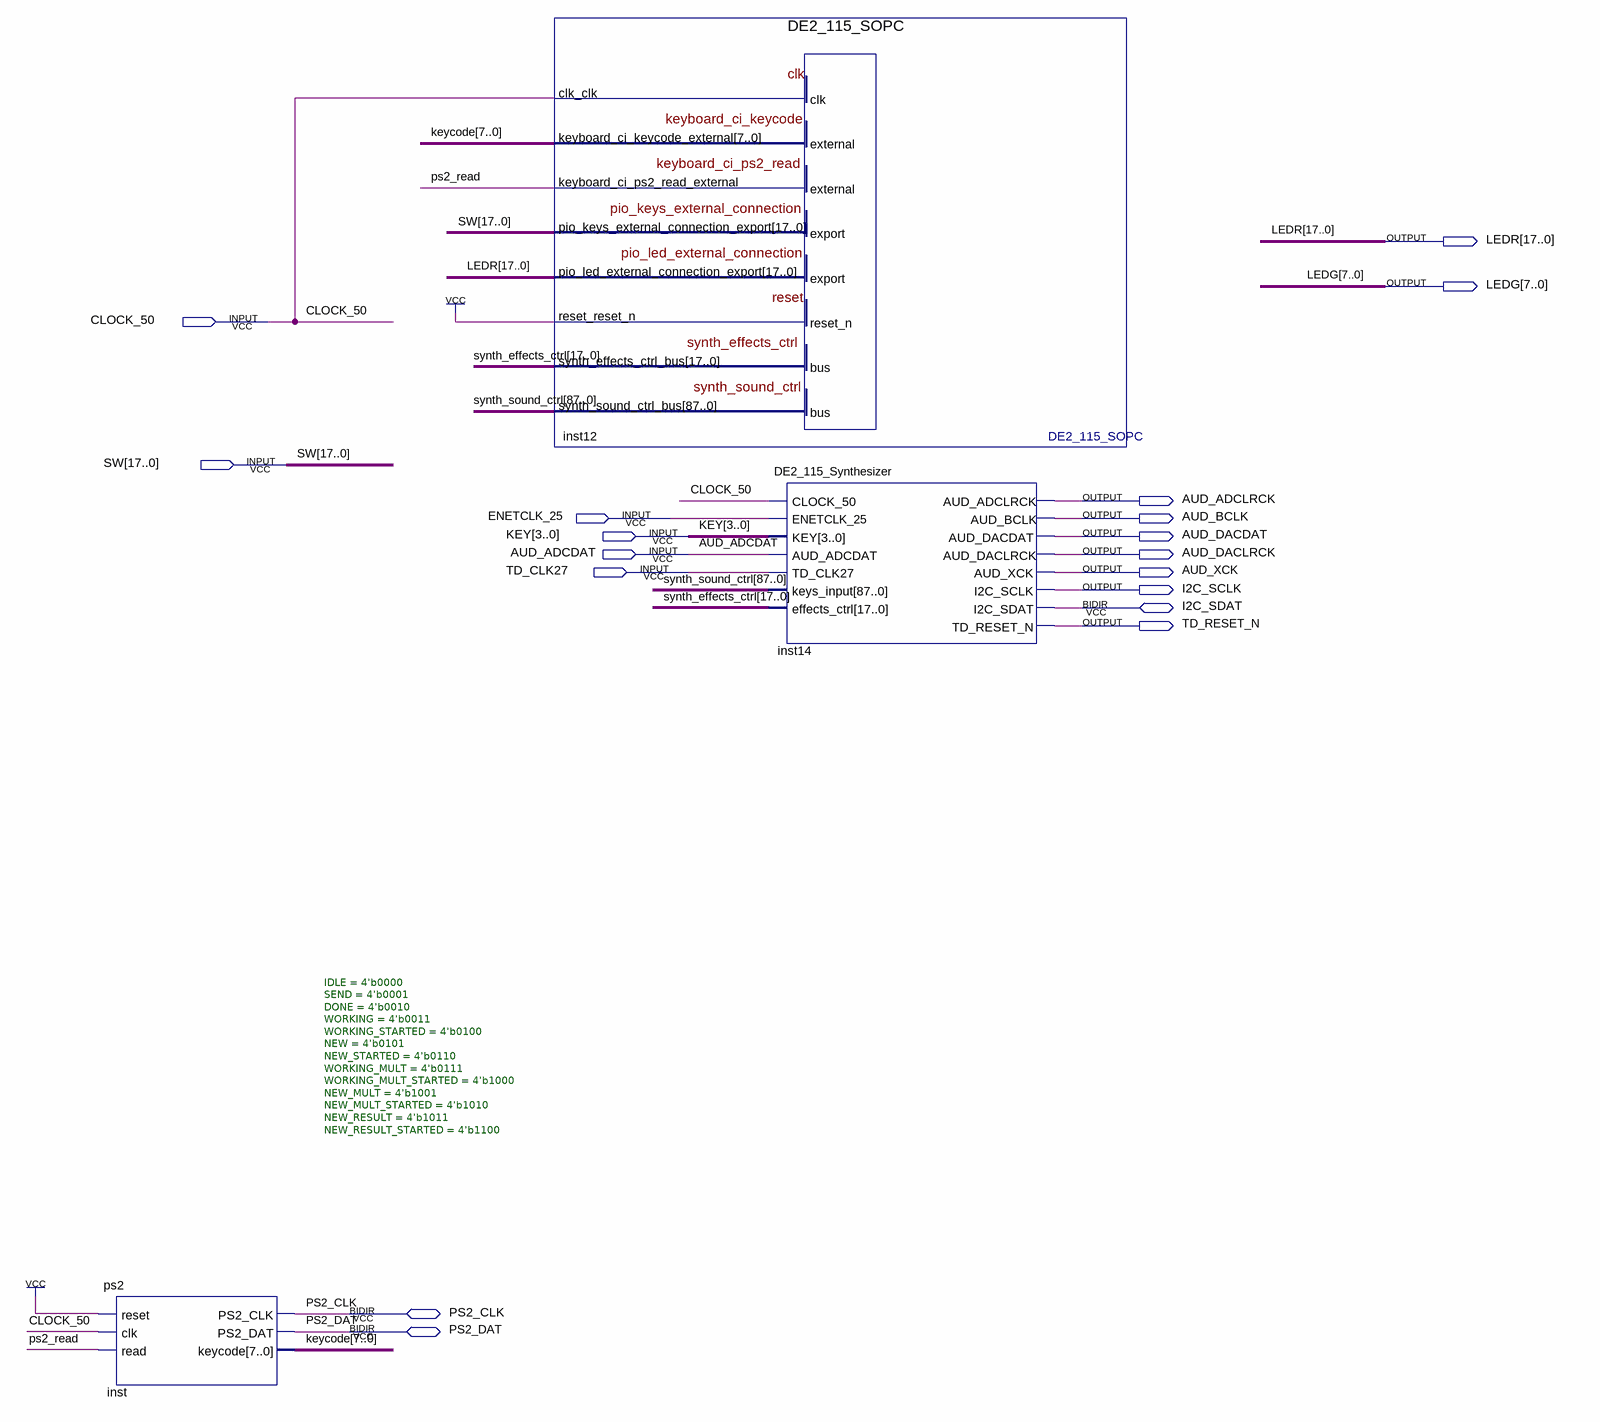
[diagram p0: schematic sheet]
// Quartus schematic Lab7.bdf as structural Verilog: 3 symbols, 18 pins
module Lab7 (
  input  CLOCK_50,
  input  [17:0] SW,
  input  ENETCLK_25,
  input  [3:0] KEY,
  input  AUD_ADCDAT,
  input  TD_CLK27,
  inout  I2C_SDAT,
  inout  PS2_CLK,
  inout  PS2_DAT,
  output [17:0] LEDR,
  output [7:0] LEDG,
  output AUD_ADCLRCK,
  output AUD_BCLK,
  output AUD_DACDAT,
  output AUD_DACLRCK,
  output AUD_XCK,
  output I2C_SCLK,
  output TD_RESET_N
);

  wire ps2_read;
  wire [7:0] keycode;
  wire [17:0] synth_effects_ctrl;
  wire [87:0] synth_sound_ctrl;

  ps2 #(.IDLE(4'b0000), .SEND(4'b0001), .DONE(4'b0010), .WORKING(4'b0011), .WORKING_STARTED(4'b0100), .NEW(4'b0101), .NEW_STARTED(4'b0110), .WORKING_MULT(4'b0111), .WORKING_MULT_STARTED(4'b1000), .NEW_MULT(4'b1001), .NEW_MULT_STARTED(4'b1010), .NEW_RESULT(4'b1011), .NEW_RESULT_STARTED(4'b1100)) inst (
    .reset(1'b1), .clk(CLOCK_50), .read(ps2_read), .keycode(keycode), .PS2_CLK(PS2_CLK), .PS2_DAT(PS2_DAT));
  DE2_115_SOPC inst12 (
    .clk_clk(CLOCK_50), .keyboard_ci_keycode_external(keycode), .pio_keys_external_connection_export(SW),
    .reset_reset_n(1'b1), .keyboard_ci_ps2_read_external(ps2_read),
    .pio_led_external_connection_export(LEDR), .synth_effects_ctrl_bus(synth_effects_ctrl),
    .synth_sound_ctrl_bus(synth_sound_ctrl));
  DE2_115_Synthesizer inst14 (
    .CLOCK_50(CLOCK_50), .ENETCLK_25(ENETCLK_25), .KEY(KEY), .AUD_ADCDAT(AUD_ADCDAT), .TD_CLK27(TD_CLK27),
    .keys_input(synth_sound_ctrl), .effects_ctrl(synth_effects_ctrl), .AUD_DACDAT(AUD_DACDAT),
    .AUD_XCK(AUD_XCK), .I2C_SCLK(I2C_SCLK), .TD_RESET_N(TD_RESET_N), .AUD_ADCLRCK(AUD_ADCLRCK),
    .AUD_BCLK(AUD_BCLK), .AUD_DACLRCK(AUD_DACLRCK), .I2C_SDAT(I2C_SDAT));
endmodule
